# EasyEDA Pro project ProProject_PetCareSTM32_MiniSTM32_2024-08-26.epro

# Schematic Schematic1
Create Date: 2024-08-11; Page Name: P1; Project Name: PetCareSTM32_MiniSTM32; Schematic Name: Schematic1; Update Date: 2024-08-25; Company: 嘉立创EDA; Page Size: A4; Version: V1.0
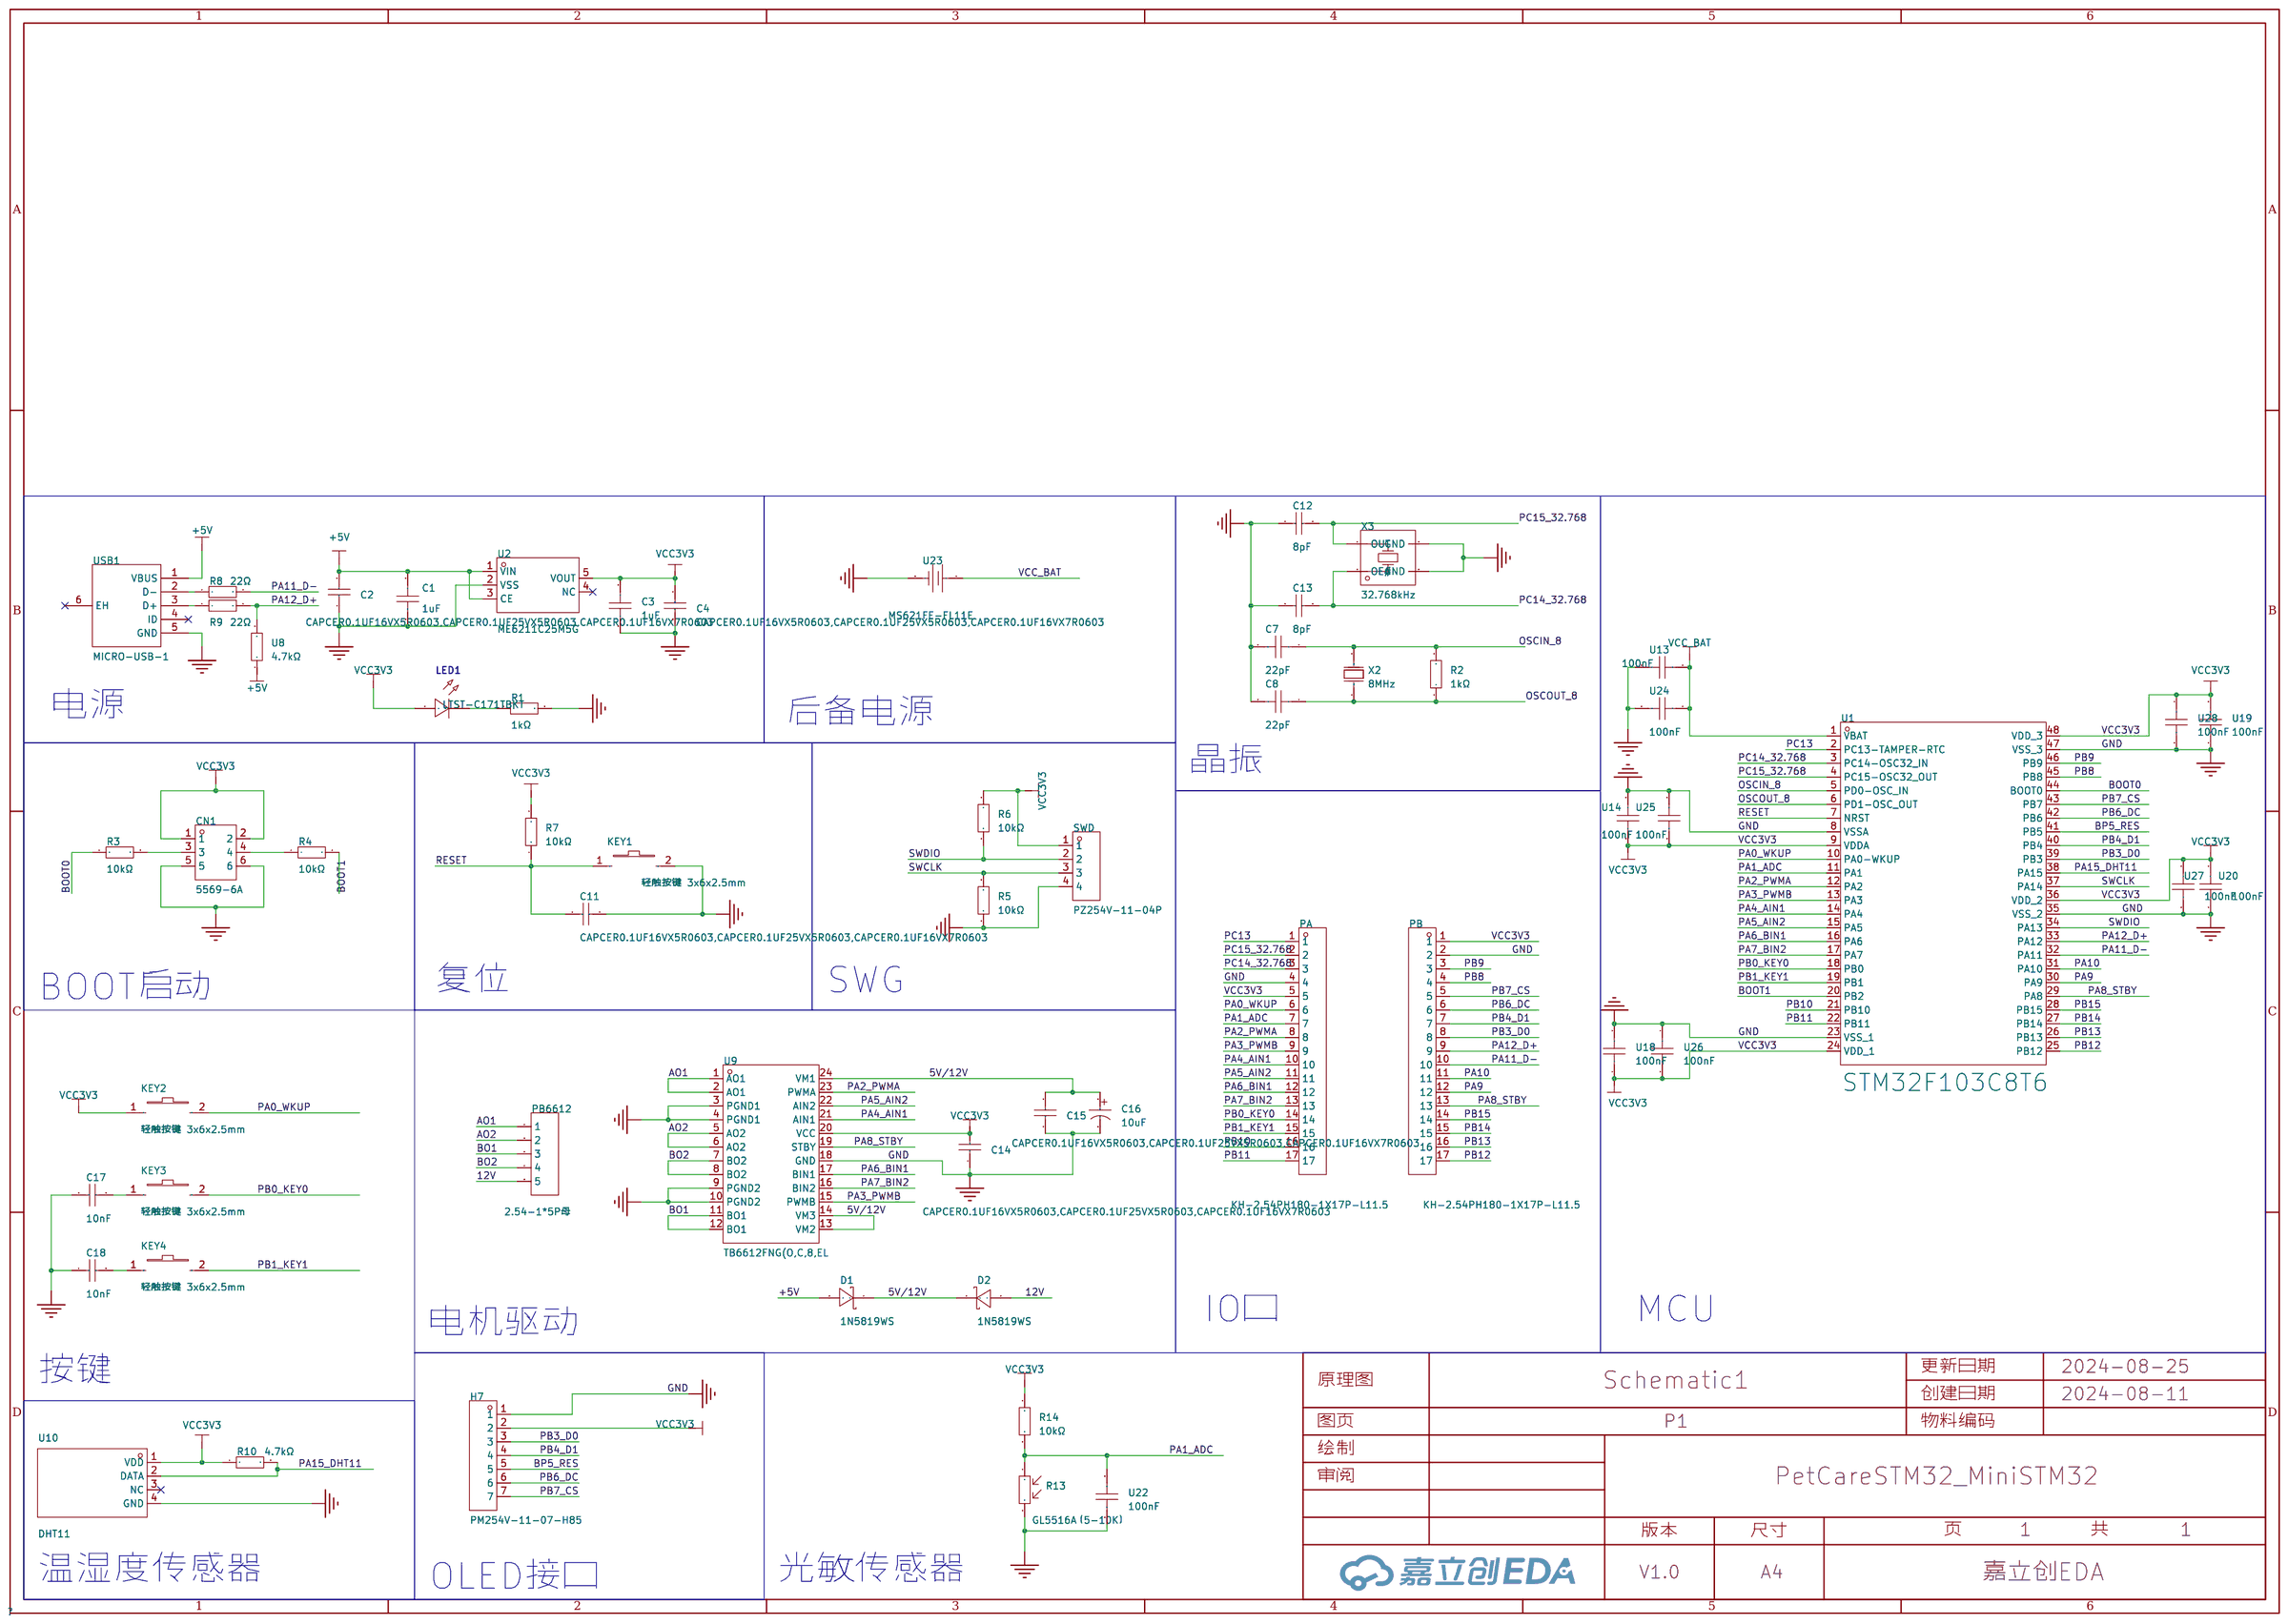
[diagram p0: schematic sheet]

## Parts
C1  1uF  [C0603]
C2  CAPCER0.1UF16VX5R0603,CAPCER0.1UF25VX5R0603,CAPCER0.1UF16VX7R0603  [C0603]
C3  1uF  [C0603]
C4  CAPCER0.1UF16VX5R0603,CAPCER0.1UF25VX5R0603,CAPCER0.1UF16VX7R0603  [C0603]
C7  22pF  [C0603]
C8  22pF  [C0603]
C11  CAPCER0.1UF16VX5R0603,CAPCER0.1UF25VX5R0603,CAPCER0.1UF16VX7R0603  [C0603]
C12  8pF  [C0603]
C13  8pF  [C0603]
C14  CAPCER0.1UF16VX5R0603,CAPCER0.1UF25VX5R0603,CAPCER0.1UF16VX7R0603  [C0603]
C15  CAPCER0.1UF16VX5R0603,CAPCER0.1UF25VX5R0603,CAPCER0.1UF16VX7R0603  [C0603]
C16  10uF  [CAP-TH_BD5.0-P2.00-D0.8-FD]
C17  10nF  [C0603]
C18  10nF  [C0603]
CN1  5569-6A  [CONN-TH_6P-P4.20_5569-6A-1]
D1  1N5819WS  [SOD-323_L1.8-W1.3-LS2.5-RD]
D2  1N5819WS  [SOD-323_L1.8-W1.3-LS2.5-RD]
H7  PM254V-11-07-H85  [HDR-TH_7P-P2.54-V-F]
KEY1  轻触按键 3x6x2.5mm  [SW-SMD_L6.0-W3.6-LS8.0]
KEY2  轻触按键 3x6x2.5mm  [SW-SMD_L6.0-W3.6-LS8.0]
KEY3  轻触按键 3x6x2.5mm  [SW-SMD_L6.0-W3.6-LS8.0]
KEY4  轻触按键 3x6x2.5mm  [SW-SMD_L6.0-W3.6-LS8.0]
LED1  LTST-C171TBKT  [LED0805-RD_BLUE]
PA  KH-2.54PH180-1X17P-L11.5  [HDR-TH_17P-P2.54-V-M]
PB  KH-2.54PH180-1X17P-L11.5  [HDR-TH_17P-P2.54-V-M]
PB6612  2.54-1*5P母  [HDR-TH_5P-P2.54-V-F]
R1  1kΩ  [R0603]
R2  1kΩ  [R0603]
R3  10kΩ  [R0603]
R4  10kΩ  [R0603]
R5  10kΩ  [R0603]
R6  10kΩ  [R0603]
R7  10kΩ  [R0603]
R8  22Ω  [R0805]
R9  22Ω  [R0805]
R10  4.7kΩ  [R1206]
R13  GL5516A（5-10K）  [RES-TH_L5.1-W4.3-P3.40_GL55]
R14  10kΩ  [R0603]
SWD  PZ254V-11-04P  [HDR-TH_4P-P2.54-V-M]
U1  STM32F103C8T6  [LQFP-48_L7.0-W7.0-P0.50-LS9.0-BL]
U2  ME6211C25M5G  [SOT-23-5_L2.9-W1.7-P0.95-LS2.8-BL]
U8  4.7kΩ  [R0603]
U9  TB6612FNG(O,C,8,EL  [SSOP-24_L8.4-W5.8-P0.65-LS7.8-BL]
U10  DHT11  [SENSOR-TH_DHT11]
U13  100nF  [C0603]
U14  100nF  [C0603]
U18  100nF  [C0603]
U19  100nF  [C0603]
U20  100nF  [C0603]
U22  100nF  [C0603]
U23  MS621FE-FL11E  [BAT-SMD_FL11E]
U24  100nF  [C0603]
U25  100nF  [C0603]
U26  100nF  [C0603]
U27  100nF  [C0603]
U28  100nF  [C0603]
USB1  MICRO-USB-1  [MICRO-USB-SMD_C9900008946]
X2  8MHz  [OSC-SMD_L5.0-W3.2]
X3  32.768kHz  [CRYSTAL-SMD_4P-L8.0-W3.8-BL]

## Library data of the parts
C1 C3 = CL10A105KB8NNNC: 容值:1uF;精度:±10%;额定电压:50V;材质(温度系数):X5R;; LCSC Part Name: 1uF ±10% 50V; Supplier Part: C15849; Manufacturer: SAMSUNG(三星); Supplier Footprint: 0603; JLCPCB Part Class: Basic Part; Datasheet: https://atta.szlcsc.com/upload/public/pdf/source/20160218/1457707763339.pdf; Supplier: LCSC; Tolerance: ±10%; Voltage Rated: 50V; Temperature Coefficient: X5R
C2 C4 C11 C14 C15 = CAPCER0.1UF16VX5R0603,CAPCER0.1UF25VX5R0603,CAPCER0.1UF16VX7R0603: Supplier Part: C9900012833; JLCPCB Part Class: Extended Part; Supplier: LCSC
C7 C8 = CL10C220JB81PNC: 容值:22pF;精度:±5%;额定电压:50V;材质(温度系数):C0G;; LCSC Part Name: 22pF ±5% 50V; Supplier Part: C170132; Manufacturer: SAMSUNG(三星); Supplier Footprint: 0603; JLCPCB Part Class: Extended Part; Datasheet: https://atta.szlcsc.com/upload/public/pdf/source/20180126/C170132_15169630833661310807.pdf; Supplier: LCSC; Tolerance: ±5%; Voltage Rated: 50V; Temperature Coefficient: C0G
C12 C13 = 0603CG8R0C500NT: 容值:8pF;额定电压:50V;材质(温度系数):C0G;; LCSC Part Name: 8pF 50V; Supplier Part: C36508; Manufacturer: FH(风华); Supplier Footprint: 0603; JLCPCB Part Class: Extended Part; Datasheet: https://atta.szlcsc.com/upload/public/pdf/source/20200305/C486355_26A10D38EF8C2A5C37091D0039909270.pdf; Supplier: LCSC; Voltage Rated: 50V; Temperature Coefficient: C0G
C16 = KF100M025C110A: 容值:10uF;精度:±20%;额定电压:25V;; LCSC Part Name: 10uF ±20% 25V; Supplier Part: C62930; Manufacturer: CapXon(丰宾); Supplier Footprint: 插件,D5xL11mm; JLCPCB Part Class: Extended Part; Datasheet: https://atta.szlcsc.com/upload/public/pdf/source/20160702/1467448308274.pdf; Supplier: LCSC; Tolerance: ±20%; Rated Voltage: 25V; Lead Spacing: 2mm; φD: 5mm; L: 11mm; Lifetime @ Temp: 2000hrs@105℃
C17 C18 = CC0603KRX7R9BB103: 容值:10nF;精度:±10%;额定电压:50V;材质(温度系数):X7R;; LCSC Part Name: 10nF ±10% 50V; Supplier Part: C100042; Manufacturer: YAGEO(国巨); Supplier Footprint: 0603; JLCPCB Part Class: Extended Part; Datasheet: https://atta.szlcsc.com/upload/public/pdf/source/20181008/C309510_22F155564471FAF6A489F7D68F34234E.pdf; Supplier: LCSC; Tolerance: ±10%; Voltage Rated: 50V; Temperature Coefficient: X7R
CN1 = 5569-6A: Supplier Part: C9900070523; Supplier Footprint: 2*3p; JLCPCB Part Class: Extended Part; Supplier: LCSC
D1 D2 = 1N5819WS_C191023: 正向压降(Vf):600mV@1A;直流反向耐压(Vr):40V;平均整流电流(Io):1A;; LCSC Part Name: 电压:40V 电流:1A; Supplier Part: C191023; Manufacturer: Hottech(合科泰); Supplier Footprint: SOD-323; JLCPCB Part Class: Basic Part; Datasheet: https://atta.szlcsc.com/upload/public/pdf/source/20220428/3CB86FD8D28D653594B4E35F9D5AEFD9.pdf; Supplier: LCSC; Forward Voltage (Vf@If): 600mV@1A; Reverse Voltage (Vr): 40V; Average Rectified Current (Io): 1A
H7 = PM254V-11-07-H85: 插孔结构:1x7P;间距:2.54mm;行距:-;圆孔/方孔:方孔;安装类型:直插;排数:单排;总孔位数:7P;额定电流:3A;额定电压:250V;插孔方向:顶部;塑高:-;工作温度范围:-40℃~+105℃;; LCSC Part Name: 间距:2.54mm 1x7P 直插; Supplier Part: C2832270; Manufacturer: XFCN(兴飞); Supplier Footprint: 插件,P=2.54mm; JLCPCB Part Class: Extended Part; Datasheet: https://atta.szlcsc.com/upload/public/pdf/source/20210514/C2832270_F424CC0071A81298BFB56B53406F9842.pdf; Supplier: LCSC; Holes Structure: 1x7P; Pitch: 2.54mm; Circular Hole / Square Hole: 方孔; Mounting Type: 直插; Number of Rows: 单排; Number of Holes: 7P; Current Rating (Max): 3A; Voltage Rating (Max): 250V; Holes Direction: 顶部; Operating Temperature Range: -40℃~+105℃
KEY1-KEY4 = 轻触按键 3x6x2.5mm: LCSC Part Name: 3x6x2.5 红头 耐高温; Supplier Part: C5382; Supplier Footprint: SMD; JLCPCB Part Class: Extended Part; Supplier: LCSC
LED1 = LTST-C171TBKT: 发光颜色:蓝色;正向电压(VF):3.3V;功率:76mW;正向电流:20mA;主波长:465nm~475nm;二极管配置:-;透镜颜色:无色透明透镜;色温:-;发光强度:104mcd;发光角度:130°;载带方式:-;工作温度:-20℃~+80℃;; LCSC Part Name: 蓝灯; Supplier Part: C98225; Manufacturer: LITEON(光宝); Supplier Footprint: 0805; JLCPCB Part Class: Extended Part; Datasheet: https://atta.szlcsc.com/upload/public/pdf/source/20170818/C98225_1503051350955895434.pdf; Supplier: LCSC; Emitted Color: 蓝色; Forward Voltage (VF): 3.3V; Power Dissipation: 76mW; Forward Current: 20mA; Dominant Wavelength: 465nm~475nm; Peak Wavelength: 468nm; Lens Color: 无色透明透镜; Luminous Intensity: 104mcd; Viewing Angle: 130°; Operating Temperature: -20℃~+80℃
PA PB = KH-2.54PH180-1X17P-L11.5: 插针结构:1x17P;间距:2.54mm;行距:-;圆针/方针:方针;安装类型:直插;排数:单排;总PIN位数:17P;额定电流:3A;额定电压:-;配合针长度:6mm;塑高:2.5mm;端接针长度:3mm;工作温度范围:-40℃~+105℃;颜色:黑色;; LCSC Part Name: 间距:2.54mm 1x17P 直插 方针; Supplier Part: C2932705; Manufacturer: kinghelm(金航标); Supplier Footprint: 插件,P=2.54mm; JLCPCB Part Class: Extended Part; Datasheet: https://atta.szlcsc.com/upload/public/pdf/source/20211220/20932CDD9C2552710798341E35ADE8E4.pdf; Supplier: LCSC; Pin Structure: 1x17P; Pitch: 2.54mm; Circluar Pins/Square Pins: 方针; Mounting Type: 直插; Number of Rows: 单排; Number of Pins: 17P; Current Rating (Max): 3A; Length of Mating Pin: 6mm; Insulation Height: 2.5mm; Length of End Connection Pin: 3mm; Operating Temperature Range: -40℃~+105℃; Color: 黑色
PB6612 = 2.54-1*5P母: 插孔结构:1x5P;间距:2.54mm;行距:-;安装类型:直插;排数:单排;总孔位数:5P;塑高:-;触头材质:-;触头镀层:-;; LCSC Part Name: 间距:2.54mm 1x5P 直插; Supplier Part: C50950; Manufacturer: BOOMELE(博穆精密); Supplier Footprint: 插件,P=2.54mm; JLCPCB Part Class: Extended Part; Datasheet: https://atta.szlcsc.com/upload/public/pdf/source/20210301/C2718488_F4427B881E42CAA8DDB0B1C12B3A522C.pdf; Supplier: LCSC; Holes Structure: 1x5P; Pitch: 2.54mm; Mounting Type: 直插; Number of Rows: 单排; Number of Holes: 5P
R1 = RC0603FR-071KL: 电阻类型:厚膜电阻;阻值:1kΩ;精度:±1%;功率:100mW;最大工作电压:75V;温度系数:±100ppm/℃;; LCSC Part Name: 厚膜电阻 1kΩ ±1% 100mW; Supplier Part: C22548; Manufacturer: YAGEO(国巨); Supplier Footprint: 0603; JLCPCB Part Class: Extended Part; Datasheet: https://atta.szlcsc.com/upload/public/pdf/source/20180316/70C0E2BDAE7FCC62C531A5A58D202EE1.pdf; Supplier: LCSC; Type: 厚膜电阻; Tolerance: ±1%; Power(Watts): 100mW; Overload Voltage (Max): 75V; Temperature Coefficient: ±100ppm/℃; Operating Temperature Range: -55℃~+155℃
R2 = 0603WAD1001T5E: 电阻类型:厚膜电阻;阻值:1kΩ;精度:±0.5%;功率:100mW;最大工作电压:75V;温度系数:±100ppm/℃;; LCSC Part Name: 1kΩ ±0.5% 100mW 厚膜电阻; Supplier Part: C51218; Manufacturer: UNI-ROYAL(厚声); Supplier Footprint: 0603; JLCPCB Part Class: Extended Part; Datasheet: https://atta.szlcsc.com/upload/public/pdf/source/20200306/C422600_1E6D84923E4A46A82E41ADD87F860B5C.pdf; Supplier: LCSC; Type: 厚膜电阻; Tolerance: ±0.5%; Power(Watts): 100mW; Overload Voltage (Max): 75V; Temperature Coefficient: ±100ppm/℃; Operating Temperature Range: -55℃~+155℃
R3-R7 R14 = 0603WAF1002T5E: 电阻类型:厚膜电阻;阻值:10kΩ;精度:±1%;功率:100mW;最大工作电压:75V;温度系数:±100ppm/℃;; LCSC Part Name: 厚膜电阻 10kΩ ±1% 100mW; Supplier Part: C25804; Manufacturer: UNI-ROYAL(厚声); Supplier Footprint: 0603; JLCPCB Part Class: Basic Part; Datasheet: https://atta.szlcsc.com/upload/public/pdf/source/20200306/C422600_1E6D84923E4A46A82E41ADD87F860B5C.pdf; Supplier: LCSC; Type: 厚膜电阻; Tolerance: ±1%; Power(Watts): 100mW; Overload Voltage (Max): 75V; Temperature Coefficient: ±100ppm/℃; Operating Temperature Range: -55℃~+155℃
R8 R9 = TC0525F220JT5E: 电阻类型:薄膜电阻;阻值:22Ω;精度:±1%;功率:250mW;最大工作电压:150V;温度系数:±25ppm/℃;; LCSC Part Name: 22Ω ±1% 250mW 薄膜电阻; Supplier Part: C65068; Manufacturer: UNI-ROYAL(厚声); Supplier Footprint: 0805; JLCPCB Part Class: Extended Part; Datasheet: https://atta.szlcsc.com/upload/public/pdf/source/20190904/C425668_F2F639A313B6F33D501F342892FD5229.pdf; Supplier: LCSC; Type: 薄膜电阻; Tolerance: ±1%; Power(Watts): 250mW; Overload Voltage (Max): 150V; Temperature Coefficient: ±25ppm/℃; Operating Temperature Range: -55℃~+155℃
R10 = 1206W4F4701T5E: 电阻类型:厚膜电阻;阻值:4.7kΩ;精度:±1%;功率:250mW;最大工作电压:200V;温度系数:±100ppm/℃;; LCSC Part Name: 4.7kΩ ±1% 250mW 厚膜电阻; Supplier Part: C17936; Manufacturer: UNI-ROYAL(厚声); Supplier Footprint: 1206; JLCPCB Part Class: Basic Part; Datasheet: https://atta.szlcsc.com/upload/public/pdf/source/20200306/C422600_1E6D84923E4A46A82E41ADD87F860B5C.pdf; Supplier: LCSC; Type: 厚膜电阻; Tolerance: ±1%; Power(Watts): 250mW; Overload Voltage (Max): 200V; Temperature Coefficient: ±100ppm/℃; Operating Temperature Range: -55℃~+155℃
R13 = GL5516A（5-10K）: 暗电阻:200kΩ;亮电阻 @ 10Lux:5kΩ~10kΩ;光谱峰值(波长):540nm;; LCSC Part Name: 亮电阻:5kΩ~10kΩ 暗电阻:200kΩ; Supplier Part: C11307; Manufacturer: JCHL(晶创和立); Supplier Footprint: 插件,P=3.4mm; JLCPCB Part Class: Extended Part; Datasheet: https://atta.szlcsc.com/upload/public/pdf/source/20200417/C515010_C10502EF7F431E893A7F20DB83F527F0.pdf; Supplier: LCSC; Dark Resistance: 200kΩ; Illuminated Resistance @ 10Lux: 5kΩ~10kΩ; Applied Voltage: 150V; Spectral Peak: 540nm
SWD = PZ254V-11-04P: 插针结构:1x4P;间距:2.54mm;行距:-;圆针/方针:方针;安装类型:直插;排数:单排;总PIN位数:4P;额定电流:3A;额定电压:250V;配合针长度:6mm;塑高:2.5mm;端接针长度:3mm;触头材质:-;工作温度范围:-40℃~+105℃;颜色:黑色;; LCSC Part Name: 间距:2.54mm 1x4P 直插 方针; Supplier Part: C2691448; Manufacturer: XFCN(兴飞); Supplier Footprint: 插件,P=2.54mm; JLCPCB Part Class: Extended Part; Datasheet: https://atta.szlcsc.com/upload/public/pdf/source/20200309/C492403_F9F19131791D08044AD4F84F8E751A34.pdf; Supplier: LCSC; Pin Structure: 1x4P; Pitch: 2.54mm; Circluar Pins/Square Pins: 方针; Mounting Type: 直插; Number of Rows: 单排; Number of Pins: 4P; Current Rating (Max): 3A; Voltage Rating (Max): 250V; Length of Mating Pin: 6mm; Insulation Height: 2.5mm; Length of End Connection Pin: 3mm; Operating Temperature Range: -40℃~+105℃; Color: 黑色
U1 = STM32F103C8T6: CPU内核:ARM-M3;程序存储容量:64KB;RAM总容量:20KB;GPIO端口数量:37;工作电压范围:2V~3.6V;CPU最大主频:72MHz;程序存储器类型:FLASH;; LCSC Part Name: 主流增强型ARM Cortex-M3 MCU，具有64 KB Flash、72 MHz CPU、电机控制、USB和CAN; Supplier Part: C8734; Manufacturer: ST(意法半导体); Supplier Footprint: LQFP-48(7x7); JLCPCB Part Class: 扩展库; Datasheet: https://atta.szlcsc.com/upload/public/pdf/source/20220812/8363ACEC51AD55ECEB84799464F7CB85.pdf; Supplier: LCSC; CPU Core: ARM-M3; Program Storage Size: 64KB; RAM Size: 20KB; GPIO Ports Number: 37; Operating Voltage Range: 2V~3.6V; CPU Maximum Speed: 72MHz; Program Memory Type: FLASH; Operating Temperature Range: -40℃~+85℃; ADC (Bit): 12bit; Universal Serial Bus: 有; Peripheral/Function: 看门狗；DMA；看门狗；温度传感器; Watchdog: 有; Infrared Data Association: 有; Low-Voltage Detect: 有; Direct Memory Access: 有; Internal Oscillator: 有
U2 = ME6211C25M5G: LCSC Part Name: ME6211C25M5G 停产; Supplier Part: C2835813; Manufacturer: MICRONE(南京微盟); Supplier Footprint: SOT-23-5; JLCPCB Part Class: Extended Part; Datasheet: https://atta.szlcsc.com/upload/public/pdf/source/20211210/ACC7C3E9BA56F250BF966425916E32B9.pdf; Supplier: LCSC
U8 = AR03FTDX4701A: 电阻类型:薄膜电阻;阻值:4.7kΩ;精度:±1%;功率:100mW;最大工作电压:75V;温度系数:±50ppm/℃;; LCSC Part Name: 薄膜电阻 4.7kΩ ±1% 100mW; Supplier Part: C2924150; Manufacturer: Viking(光颉); Supplier Footprint: 0603; JLCPCB Part Class: Extended Part; Datasheet: https://atta.szlcsc.com/upload/public/pdf/source/20211123/7AFDB03DAF68AA91648A852AAE26A3AB.pdf; Supplier: LCSC; Type: 薄膜电阻; Tolerance: ±1%; Power(Watts): 100mW; Overload Voltage (Max): 75V; Temperature Coefficient: ±50ppm/℃; Operating Temperature Range: -55℃~+155℃
U9 = TB6612FNG(O,C,8,EL: 双直流电机驱动器集成电路; Supplier Part: C88224; Manufacturer: TOSHIBA(东芝); Supplier Footprint: SSOP-24-208mil; JLCPCB Part Class: Extended Part; Datasheet: https://atta.szlcsc.com/upload/public/pdf/source/20171128/C141517_15118625624231147036.pdf; Supplier: LCSC
U10 = DHT11: 新款电容式数字温湿度传感器,老款已停产16.1x12.6x5.8mm; LCSC Part Name: DHT11  电容式传感器; Supplier Part: C117051; Manufacturer: 广州奥松; Supplier Footprint: SIP-4; JLCPCB Part Class: Extended Part; Datasheet: https://atta.szlcsc.com/upload/public/pdf/source/20170703/1499081238365.pdf; Supplier: LCSC
U13 U14 U18-U20 U22 U24-U28 = CGA0603X7R104K500JT: 容值:100nF;精度:±10%;额定电压:50V;材质(温度系数):X7R;; LCSC Part Name: 100nF ±10% 50V; Supplier Part: C6119867; Manufacturer: HRE(芯声); Supplier Footprint: 0603; JLCPCB Part Class: Extended Part; Supplier: LCSC; Tolerance: ±10%; Voltage Rated: 50V; Temperature Coefficient: X7R
U23 = MS621FE-FL11E: FL11E 3.3V可充电纽扣电池 5.5mAH; LCSC Part Name: Seiko/精工，可充电纽扣电池，3V，MS621FE-FL11E，1个; Supplier Part: C80909; Manufacturer: Seiko(精工); JLCPCB Part Class: Extended Part; Datasheet: https://atta.szlcsc.com/upload/public/pdf/source/20230719/88F2811CC6B30DD05F1C5A5953BF9E77.pdf; Supplier: LCSC; voltage: 3 V; capacity: 5.5mAh; chemical composition: 锂离子; temperature range: -20-60°C; type: 纽扣; characteristic: 可充电; Packaging quantity: 1; Battery capacity: -；-；-
USB1 = MICRO-USB-1: Supplier Part: C9900008946; Supplier Footprint: USB-micro; JLCPCB Part Class: Extended Part; Supplier: LCSC
X2 = ABM3-8.000MHZ-D2Y-T: 晶振类型:贴片晶振;频率:8MHz;常温频差:±20ppm;外接负载电容:18pF;频率稳定度(全温):±30ppm;; LCSC Part Name: 8MHz ±20ppm 18pF; Supplier Part: C144380; Manufacturer: ABRACON; Supplier Footprint: SMD5032; JLCPCB Part Class: Extended Part; Datasheet: https://atta.szlcsc.com/upload/public/pdf/source/20180613/C148313_0A3B1F233FF88ED3B220BE4C181ABF14.pdf; Supplier: LCSC; Crystal Type: 贴片晶振; Normal temperature Frequency Tolerance: ±20ppm; External load capacitor: 18pF; Frequency Stability(Full temperature range): ±30ppm; Equivalent Series Resistance (ESR): 140Ω; Operating Temperature: -40℃~+85℃
X3 = ABS25-32.768KHZ-T: 晶振类型:-;频率:32.768kHz;常温频差:±20ppm;外接负载电容:12.5pF;频率稳定度(全温):-;; LCSC Part Name: 32.768kHz ±20ppm 12.5pF; Supplier Part: C179637; Manufacturer: ABRACON; Supplier Footprint: MC-306; JLCPCB Part Class: 扩展库; Datasheet: https://atta.szlcsc.com/upload/public/pdf/source/20180207/C179637_15179896523281356363.pdf; Supplier: LCSC; Normal temperature Frequency Tolerance: ±20ppm; External load capacitor: 12.5pF; Equivalent Series Resistance (ESR): 50kΩ; Operating Temperature: -40℃~+85℃

## Nets
5V/12V: C15.2 C16.1 D1.1(K) D2.1(K) U9.13(VM2) U9.14(VM3) U9.24(VM1)
12V: D2.2(A) PB6612.5
+5V: C1.2 C2.2 D1.2(A) U2.1(VIN) U2.3(CE) U8.1 USB1.1(VBUS)
GND: C1.1 C2.1 C3.1 C4.1 C7.2 C8.2 C11.2 C12.1 C13.1 C14.1 C15.1 C16.2 C17.2 C18.1 CN1.5 CN1.6 H7.1 KEY1.2 PA.4 PB.2 R1.2 R5.1 R13.2 SWD.4 U1.8(VSSA) U1.23(VSS_1) U1.35(VSS_2) U1.47(VSS_3) U2.2(VSS) U9.3(PGND1) U9.4(PGND1) U9.9(PGND2) U9.10(PGND2) U9.18(GND) U10.4(GND) U13.2 U14.2 U18.2 U19.1 U20.1 U22.1 U23.2(-) U24.2 U25.1 U26.1 U27.2 U28.2 USB1.5(GND) X3.2(GND) X3.3(GND)
VCC3V3: C3.2 C4.2 C14.2 CN1.1 CN1.2 H7.2 KEY2.1 LED1.2(A) PA.5 PB.1 R6.2 R7.2 R10.1 R14.2 SWD.1 U1.9(VDDA) U1.24(VDD_1) U1.36(VDD_2) U1.48(VDD_3) U2.5(VOUT) U9.20(VCC) U10.1(VDD) U14.1 U18.1 U19.2 U20.2 U25.2 U26.2 U27.1 U28.1
VCC_BAT: U1.1(VBAT) U13.1 U23.1(+) U24.1
AO1: PB6612.1 U9.1(AO1) U9.2(AO1)
AO2: PB6612.2 U9.5(AO2) U9.6(AO2)
BO1: PB6612.3 U9.11(BO1) U9.12(BO1)
BO2: PB6612.4 U9.7(BO2) U9.8(BO2)
BOOT0: R3.1 U1.44(BOOT0)
BOOT1: R4.2 U1.20(PB2)
BP5_RES: H7.5 U1.41(PB5)
OSCIN_8: C7.1 R2.2 U1.5(PD0-OSC_IN) X2.2(OSC2)
OSCOUT_8: C8.1 R2.1 U1.6(PD1-OSC_OUT) X2.1(OSC1)
PA0_WKUP: KEY2.2 PA.6 U1.10(PA0-WKUP)
PA1_ADC: PA.7 R13.1 R14.1 U1.11(PA1) U22.2
PA2_PWMA: PA.8 U1.12(PA2) U9.23(PWMA)
PA3_PWMB: PA.9 U1.13(PA3) U9.15(PWMB)
PA4_AIN1: PA.10 U1.14(PA4) U9.21(AIN1)
PA5_AIN2: PA.11 U1.15(PA5) U9.22(AIN2)
PA6_BIN1: PA.12 U1.16(PA6) U9.17(BIN1)
PA7_BIN2: PA.13 U1.17(PA7) U9.16(BIN2)
PA8_STBY: PB.13 U1.29(PA8) U9.19(STBY)
PA9: PB.12 U1.30(PA9)
PA10: PB.11 U1.31(PA10)
PA11_D-: PB.10 R8.2 U1.32(PA11)
PA12_D+: PB.9 R9.2 U1.33(PA12) U8.2
PA15_DHT11: R10.2 U1.38(PA15) U10.2(DATA)
PB0_KEY0: KEY3.2 PA.14 U1.18(PB0)
PB1_KEY1: KEY4.2 PA.15 U1.19(PB1)
PB3_D0: H7.3 PB.8 U1.39(PB3)
PB4_D1: H7.4 PB.7 U1.40(PB4)
PB6_DC: H7.6 PB.6 U1.42(PB6)
PB7_CS: H7.7 PB.5 U1.43(PB7)
PB8: PB.4 U1.45(PB8)
PB9: PB.3 U1.46(PB9)
PB10: PA.16 U1.21(PB10)
PB11: PA.17 U1.22(PB11)
PB12: PB.17 U1.25(PB12)
PB13: PB.16 U1.26(PB13)
PB14: PB.15 U1.27(PB14)
PB15: PB.14 U1.28(PB15)
PC13: PA.1 U1.2(PC13-TAMPER-RTC)
PC14_32.768: C13.2 PA.3 U1.3(PC14-OSC32_IN) X3.1(OE#)
PC15_32.768: C12.2 PA.2 U1.4(PC15-OSC32_OUT) X3.4(OUT)
RESET: C11.1 KEY1.1 R7.1 U1.7(NRST)
SWCLK: R5.2 SWD.3 U1.37(PA14)
SWDIO: R6.1 SWD.2 U1.34(PA13)
$1N4524: LED1.1(C) R1.1
$1N6705: CN1.3 R3.2
$1N6712: CN1.4 R4.1
$1N8192: R8.1 USB1.2(D-)
$1N8237: R9.1 USB1.3(D+)
$1N32184: C17.1 KEY3.1
$1N32195: C18.2 KEY4.1

Not connected (* = marked no-connect by the designer): U2 4(NC)*; U10 3(NC)*; USB1 4(ID)* 6(EH)*

## Notes on the sheet
- 电源
- 后备电源
- 晶振
- BOOT启动
- 复位
- SWG
- IO口
- MCU
- 电机驱动
- 按键
- 温湿度传感器
- 光敏传感器
- OLED接口

# Board PCB1
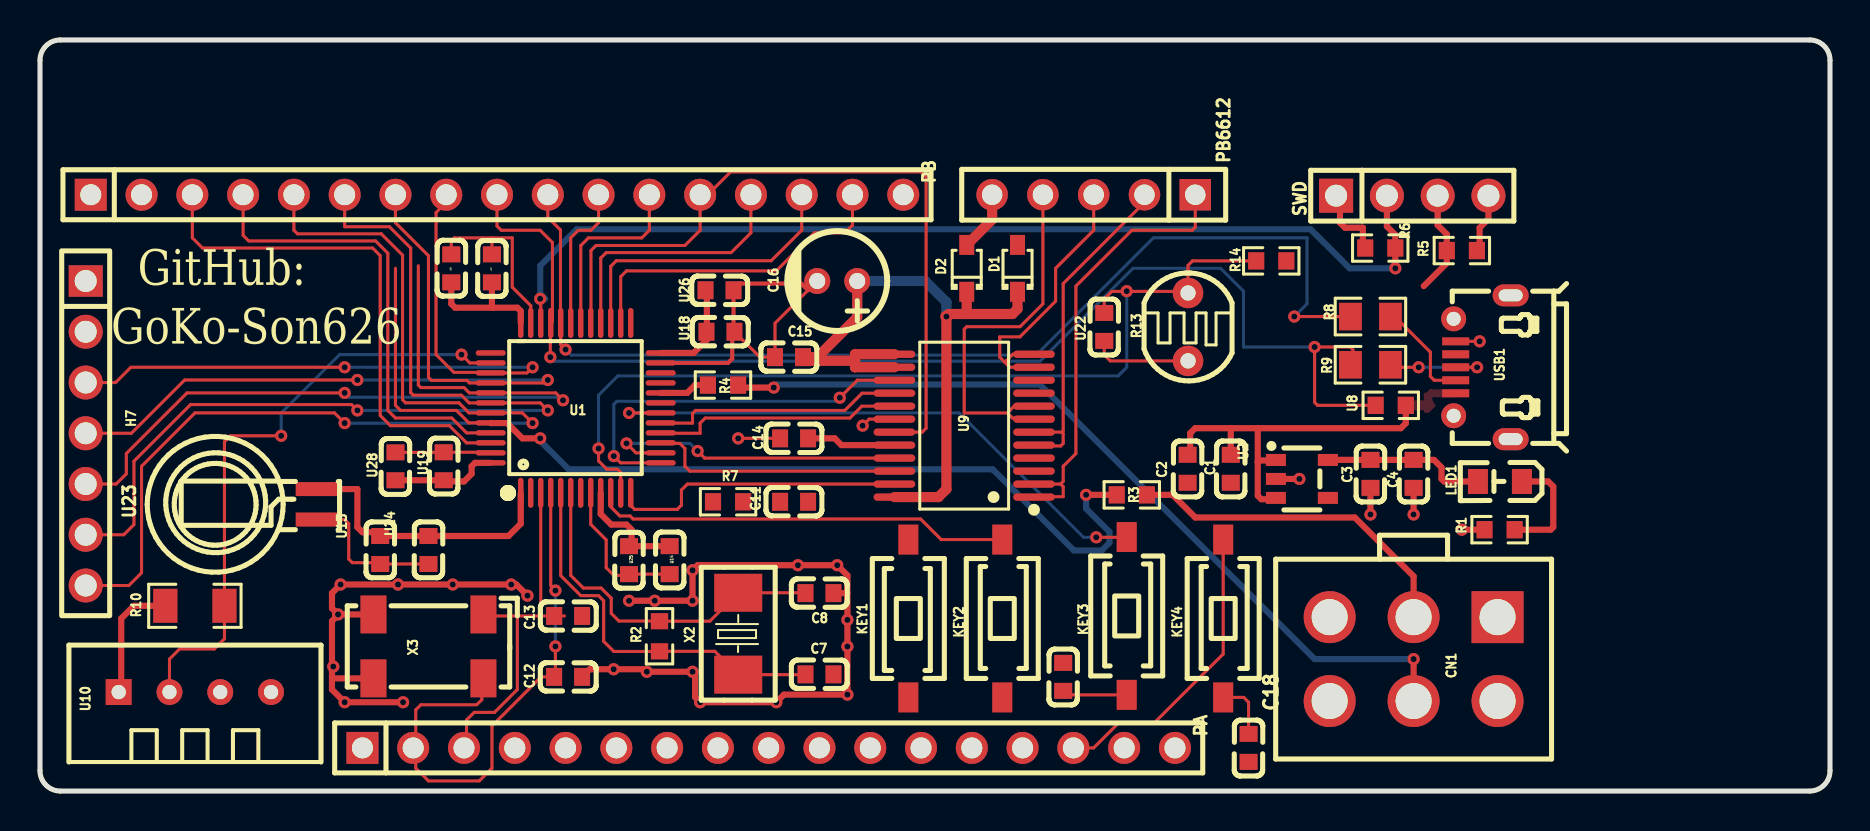
[diagram p1: board, top side]
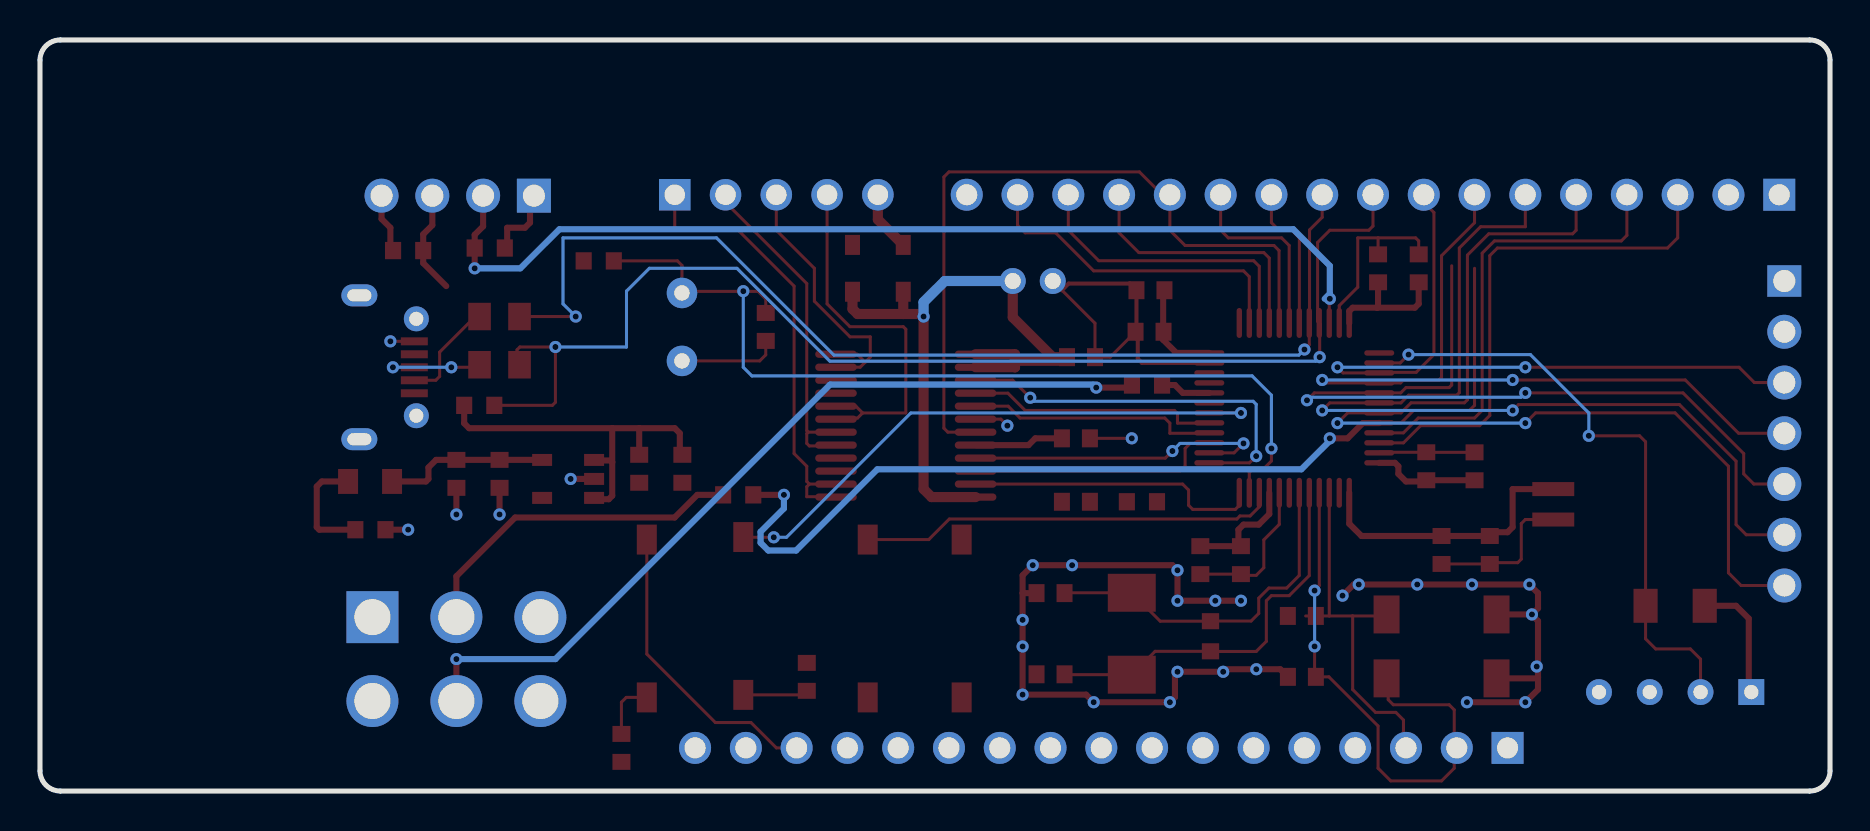
[diagram p2: board, bottom side, seen from below]

Outline 89.54 x 37.59 mm; copper layers: Top Layer, Bottom Layer. Coordinates in mm from the lower left corner of the outline.
Outline path: 0,36.58 0,1.02 arc(0.3,0.3) 1.02,0 88.52,0 arc(89.24,0.3) 89.54,1.02 89.54,36.58 arc(89.24,37.29) 88.52,37.59 1.02,37.59 arc(0.3,37.29) 0,36.58
Stack: Top Layer 0.035mm / Dielectric1 1.51mm FR4 er 4.5 / Bottom Layer 0.035mm

## Design rules (mm)
net PA11_D-: DP2
net PA12_D+: DP2
net $1N8192: DP1
net $1N8237: DP1
template: 自定义配置
spacing copperThickness1oz (default): track to track 0.203, other pairs 0.203 to 0.203
spacing copperThickness2oz: track to track 0.203, other pairs 0.152 to 0.3
track width copperThickness1oz (default): min 0.152, default 0.152, max 0.305
track width copperThickness2oz: min 0.203, default 0.254, max 2.54
track width 5V: min 0.305, default 0.305, max 0.762
track width 12V: min 0.508, default 0.508, max 0.762
differential pair differentialPair (default): width min 0.152, default 0.152, max 0.152; gap min 0.152, default 0.152
via viaSize (default): diameter min 0.61, default 0.61, max 0.61; hole min 0.305, default 0.305, max 0.305
net VCC_BAT uses 5V
net VCC3V3 uses 5V
net +5V uses 5V
net 5V/12V uses 12V
net 12V uses 12V

## Placement (name value [footprint] x y rotation side)
C1  1uF  [C0603]  59.56 16.13 90 top
C2  CAPCER0.1UF16VX5R0603,CAPCER0.1UF25VX5R0603,CAPCER0.1UF16VX7R0603  [C0603]  57.4 16.13 90 top
C3  1uF  [C0603]  66.55 15.88 90 top
C4  CAPCER0.1UF16VX5R0603,CAPCER0.1UF25VX5R0603,CAPCER0.1UF16VX7R0603  [C0603]  68.71 15.88 90 top
C7  22pF  [C0603]  38.99 5.84 0 top
C8  22pF  [C0603]  38.99 9.91 0 top
C11  CAPCER0.1UF16VX5R0603,CAPCER0.1UF25VX5R0603,CAPCER0.1UF16VX7R0603  [C0603]  37.72 14.48 0 top
C12  8pF  [C0603]  26.42 5.71 180 top
C13  8pF  [C0603]  26.42 8.76 180 top
C14  CAPCER0.1UF16VX5R0603,CAPCER0.1UF25VX5R0603,CAPCER0.1UF16VX7R0603  [C0603]  37.72 17.65 0 top
C15  CAPCER0.1UF16VX5R0603,CAPCER0.1UF25VX5R0603,CAPCER0.1UF16VX7R0603  [C0603]  37.47 21.72 0 top
C16  10uF  [CAP-TH_BD5.0-P2.00-D0.8-FD]  39.88 25.53 180 top
C17  10nF  [C0603]  51.18 5.71 90 top
C18  10nF  [C0603]  60.45 2.16 90 top
CN1  5569-6A  [CONN-TH_6P-P4.20_5569-6A-1]  68.71 6.6 180 top
D1  1N5819WS  [SOD-323_L1.8-W1.3-LS2.5-RD]  48.89 26.16 90 top
D2  1N5819WS  [SOD-323_L1.8-W1.3-LS2.5-RD]  46.36 26.16 90 top
H7  PM254V-11-07-H85  [HDR-TH_7P-P2.54-V-F]  2.29 17.91 270 top
KEY1  轻触按键 3x6x2.5mm  [SW-SMD_L6.0-W3.6-LS8.0]  43.43 8.64 270 top
KEY2  轻触按键 3x6x2.5mm  [SW-SMD_L6.0-W3.6-LS8.0]  48.13 8.64 90 top
KEY3  轻触按键 3x6x2.5mm  [SW-SMD_L6.0-W3.6-LS8.0]  54.36 8.76 90 top
KEY4  轻触按键 3x6x2.5mm  [SW-SMD_L6.0-W3.6-LS8.0]  59.18 8.64 90 top
LED1  LTST-C171TBKT  [LED0805-RD_BLUE]  73.02 15.49 180 top
PA  KH-2.54PH180-1X17P-L11.5  [HDR-TH_17P-P2.54-V-M]  36.45 2.16 0 top
PB  KH-2.54PH180-1X17P-L11.5  [HDR-TH_17P-P2.54-V-M]  22.86 29.84 0 top
PB6612  2.54-1*5P母  [HDR-TH_5P-P2.54-V-F]  52.7 29.84 180 top
R1  1kΩ  [R0603]  73.01 13.08 180 top
R2  1kΩ  [R0603]  30.99 7.75 270 top
R3  10kΩ  [R0603]  54.61 14.82 0 top
R4  10kΩ  [R0603]  34.16 20.32 180 top
R5  10kΩ  [R0603]  71.12 27.05 180 top
R6  10kΩ  [R0603]  67.04 27.18 180 top
R7  10kΩ  [R0603]  34.42 14.48 180 top
R8  22Ω  [R0805]  66.55 23.75 180 top
R9  22Ω  [R0805]  66.55 21.34 180 top
R10  4.7kΩ  [R1206]  7.75 9.27 0 top
R13  GL5516A（5-10K）  [RES-TH_L5.1-W4.3-P3.40_GL55]  57.42 23.23 0 top
R14  10kΩ  [R0603]  61.59 26.53 0 top
SWD  PZ254V-11-04P  [HDR-TH_4P-P2.54-V-M]  68.64 29.8 0 top
U1  STM32F103C8T6  [LQFP-48_L7.0-W7.0-P0.50-LS9.0-BL]  26.8 19.18 0 top
U2  ME6211C25M5G  [SOT-23-5_L2.9-W1.7-P0.95-LS2.8-BL]  63.12 15.62 270 top
U8  4.7kΩ  [R0603]  67.56 19.3 180 top
U9  TB6612FNG(O,C,8,EL  [SSOP-24_L8.4-W5.8-P0.65-LS7.8-BL]  46.23 18.29 90 top
U10  DHT11  [SENSOR-TH_DHT11]  7.75 4.95 0 top
U13  100nF  [C0603]  17.02 12.06 270 top
U14  100nF  [C0603]  31.5 11.56 270 top
U18  100nF  [C0603]  34.04 22.99 0 top
U19  100nF  [C0603]  20.19 16.26 270 top
U20  100nF  [C0603]  20.57 26.16 270 top
U22  100nF  [C0603]  53.23 23.23 90 top
U23  MS621FE-FL11E  [BAT-SMD_FL11E]  13.84 14.35 0 top
U24  100nF  [C0603]  19.43 12.06 270 top
U25  100nF  [C0603]  29.46 11.56 90 top
U26  100nF  [C0603]  33.99 25.07 180 top
U27  100nF  [C0603]  22.61 26.16 90 top
U28  100nF  [C0603]  17.78 16.25 90 top
USB1  MICRO-USB-1  [MICRO-USB-SMD_C9900008946]  72.14 21.21 90 top
X2  8MHz  [OSC-SMD_L5.0-W3.2]  34.92 7.87 270 top
X3  32.768kHz  [CRYSTAL-SMD_4P-L8.0-W3.8-BL]  19.43 7.24 180 top

## Footprints (pads in the part's own frame, mm; a bottom-side part is the same pattern mirrored in y, then rotated)
BAT-SMD_FL11E
  rect 2.1x0.7 smd: 1(0,0.762) 2(0,-0.762)
C0603
  rect 0.8x0.9 smd: 1(-0.7,0) 2(0.7,0)
CAP-TH_BD5.0-P2.00-D0.8-FD
  round 1.3 hole 0.8: 1(-1,0) 2(1,0)
CONN-TH_6P-P4.20_5569-6A-1
  rect 2.6x2.6 hole 1.8: 1(-4.2,-2.1)
  round 2.6 hole 1.8: 2(-4.2,2.1) 3(0,-2.1) 4(0,2.1) 5(4.2,-2.1) 6(4.2,2.1)
CRYSTAL-SMD_4P-L8.0-W3.8-BL
  rect 1.3x1.9 smd: 1(-2.75,-1.6) 2(2.75,-1.6) 3(2.75,1.6) 4(-2.75,1.6)
HDR-TH_4P-P2.54-V-M
  rect 1.7x1.7 hole 1.1: 1(-3.81,0)
  round 1.7 hole 1.1: 2(-1.27,0) 3(1.27,0) 4(3.81,0)
HDR-TH_5P-P2.54-V-F
  rect 1.575x1.575 hole 1.02: 1(-5.08,0)
  round 1.575 hole 1.02: 2(-2.54,0) 3(0,0) 4(2.54,0) 5(5.08,0)
HDR-TH_7P-P2.54-V-F
  rect 1.575x1.7 hole 1.1: 1(-7.62,0)
  round 1.7 hole 1.1: 2(-5.08,0) 3(-2.54,0) 4(0,0) 5(2.54,0) 6(5.08,0) 7(7.62,0)
HDR-TH_17P-P2.54-V-M
  rect 1.6x1.6 hole 1.05: 1(-20.32,0)
  round 1.6 hole 1.05: 2(-17.78,0) 3(-15.24,0) 4(-12.7,0) 5(-10.16,0) 6(-7.62,0) 7(-5.08,0) 8(-2.54,0) 9(0,0) 10(2.54,0) 11(5.08,0) 12(7.62,0) 13(10.16,0) 14(12.7,0) 15(15.24,0) 16(17.78,0) 17(20.32,0)
LED0805-RD_BLUE
  rect 1x1.25 smd: 1(-1.1,0) 2(1.1,0)
LQFP-48_L7.0-W7.0-P0.50-LS9.0-BL
  oval 0.27x1.5 smd: 1(-2.75,-4.25) 2(-2.25,-4.25) 3(-1.75,-4.25) 4(-1.25,-4.25) 5(-0.75,-4.25) 6(-0.25,-4.25) 7(0.25,-4.25) 8(0.75,-4.25) 9(1.25,-4.25) 10(1.75,-4.25) 11(2.25,-4.25) 12(2.75,-4.25) 25(2.75,4.25) 26(2.25,4.25) 27(1.75,4.25) 28(1.25,4.25) 29(0.75,4.25) 30(0.25,4.25) 31(-0.25,4.25) 32(-0.75,4.25) 33(-1.25,4.25) 34(-1.75,4.25) 35(-2.25,4.25) 36(-2.75,4.25)
  oval 1.5x0.27 smd: 13(4.25,-2.75) 14(4.25,-2.25) 15(4.25,-1.75) 16(4.25,-1.25) 17(4.25,-0.75) 18(4.25,-0.25) 19(4.25,0.25) 20(4.25,0.75) 21(4.25,1.25) 22(4.25,1.75) 23(4.25,2.25) 24(4.25,2.75) 37(-4.25,2.75) 38(-4.25,2.25) 39(-4.25,1.75) 40(-4.25,1.25) 41(-4.25,0.75) 42(-4.25,0.25) 43(-4.25,-0.25) 44(-4.25,-0.75) 45(-4.25,-1.25) 46(-4.25,-1.75) 47(-4.25,-2.25) 48(-4.25,-2.75)
MICRO-USB-SMD_C9900008946
  rect 0.4x1.35 smd: 1(-1.3,1.325) 2(-0.65,1.325) 3(0,1.325) 4(0.65,1.325) 5(1.3,1.325)
  oval 1.1x1.8 hole 0.6x1.2: 6(-3.6,-1.425) 6(3.6,-1.425)
  round 1.25 hole 0.7: 6(-2.425,1.425) 6(2.425,1.425)
OSC-SMD_L5.0-W3.2
  rect 1.9x2.4 smd: 1(-2.05,0) 2(2.05,0)
R0603
  rect 0.806x0.864 smd: 1(-0.753,0) 2(0.753,0)
R0805
  rect 1.133x1.377 smd: 1(-1,0) 2(1,0)
R1206
  rect 1.208x1.701 smd: 1(-1.479,0) 2(1.479,0)
RES-TH_L5.1-W4.3-P3.40_GL55
  round 1.524 hole 0.762: 1(0,1.7) 2(0,-1.7)
SENSOR-TH_DHT11
  rect 1.296x1.296 hole 0.711: 1(-3.81,0)
  round 1.296 hole 0.711: 2(-1.27,0) 3(1.27,0) 4(3.81,0)
SOD-323_L1.8-W1.3-LS2.5-RD
  rect 1x0.75 smd: 1(-1.173,0) 2(1.173,0)
SOT-23-5_L2.9-W1.7-P0.95-LS2.8-BL
  rect 0.6x1 smd: 1(-0.95,-1.3) 2(0,-1.3) 3(0.95,-1.3) 4(0.95,1.3) 5(-0.95,1.3)
SSOP-24_L8.4-W5.8-P0.65-LS7.8-BL
  oval 0.364x2.082 smd: 1(-3.575,-3.491) 2(-2.925,-3.491) 3(-2.275,-3.491) 4(-1.625,-3.491) 5(-0.975,-3.491) 6(-0.325,-3.491) 7(0.325,-3.491) 8(0.975,-3.491) 9(1.625,-3.491) 10(2.275,-3.491) 11(2.925,-3.491) 12(3.575,-3.491) 13(3.575,3.491) 14(2.925,3.491) 15(2.275,3.491) 16(1.625,3.491) 17(0.975,3.491) 18(0.325,3.491) 19(-0.325,3.491) 20(-0.975,3.491) 21(-1.625,3.491) 22(-2.275,3.491) 23(-2.925,3.491) 24(-3.575,3.491)
SW-SMD_L6.0-W3.6-LS8.0
  rect 1.5x1 smd: 1(-3.95,0) 2(3.95,0)

## Nets
As in the schematic.

Pads without a net: U2 4; U10 3; USB1 4 6

## Via types
v1: diameter 0.61, hole 0.305, Top Layer to Bottom Layer, 65 vias

## Routing (per net, layer and track width the routed paths; a pad name or vN(x,y) marks a point on that pad's centre or on a via; arc(x,y) is an arc through that point)
5V/12V: length 35.3
  Top Layer w0.508: 46.36,23.88 48.64,23.88 48.89,24.13 D1.1 ; 46.36,23.88 45.47,23.88 v1(45.34,23.75) 45.34,15.11 44.94,14.71 U9.24 ; 46.36,23.88 D2.1 ; 40.77,21.53 40.77,21.21 40.77,21.21 U9.14 ; 40.77,21.53 40.77,21.86 U9.13 ; 40.77,21.53 38.35,21.53 C15.2 38.88,21.72 40.88,23.71 C16.1
  Bottom Layer w0.508: v1(45.34,23.75) 45.34,24.47 44.28,25.53 C16.1
12V: length 2.7
  Top Layer w0.508: D2.2 47.63,28.6 47.63,29.46
+5V: length 19.5
  Top Layer w0.305: 60.91,18.16 68.07,18.16 68.32,18.41 U8.1 ; 60.91,18.16 60.91,16.46 ; 60.91,18.16 59.56,18.16 ; 60.91,16.46 61,16.55 61.79,16.55 U2.1 ; 60.91,16.46 60.91,14.78 61.09,14.6 61.65,14.6 ; 59.56,18.16 59.56,18.16 C1.2 ; 59.56,18.16 57.79,18.16 57.53,17.91 57.53,16.96 C2.2
GND: length 122.9
  Top Layer w0.152: 38.42,25.07 36.77,23.41 C15.1 36.01,21.72 U18.2 ; U1.8 27.55,13.35 28.32,12.57 28.32,11.18 28.7,10.8 29.53,10.8 29.59,10.86 31.37,10.86 31.43,10.79 ; U20.1 20.57,27.53 20.73,27.69 22.61,27.69 ; U9.18 41.47,18.61 v1(41.15,18.29) ; R13.2 53.54,21.53 53.23,21.83 U22.1 ; U1.35 24.55,24.29 23.62,25.22 23.62,27.69 22.61,27.69 ; 22.61,27.69 U27.2 ; U28.2 20.19,16.95 20.19,16.96 22.52,16.96 U1.47 ; U24.2 U13.2 16.95,11.43 15.62,11.43 15.44,11.61 15.44,13.39 15.24,13.59 U23.2 ; C14.1 v1(34.92,17.65) ; USB1.5 v1(72.01,22.51)
  Top Layer w0.203: U1.23 34.42,21.43 34.63,21.64 34.63,22.59 34.69,22.65 U26.1 35.02,25.4 38.08,25.4 38.42,25.07 C16.2
  Top Layer w0.305: 40.39,9.91 40.39,10.8 v1(39.88,11.3) v1(37.91,11.3) 32.89,11.3 v1(32.64,11.05) v1(32.64,9.52) v1(30.75,9.52) v1(29.46,9.52) ; 40.39,9.91 C8.2 ; 40.39,9.91 v1(40.39,8.57) v1(40.39,7.23) v1(40.39,4.83) 37.21,4.83 v1(36.83,4.44) v1(33.02,4.44) 32.77,4.7 32.77,5.84 v1(32.64,5.97) v1(30.35,5.97) 30.23,6.1 v1(28.7,6.1) 27.5,6.1 C12.1 ; X3.2 14.94,8.84 ; 14.94,8.84 v1(14.91,8.84) 14.61,9.14 14.61,9.91 v1(15.04,10.34) v1(17.91,10.34) v1(20.65,10.34) v1(23.57,10.34) 23.83,10.34 v1(24.38,9.78) ; 14.94,8.84 14.61,8.51 14.61,5.7 ; 18.29,4.44 v1(15.24,4.44) 14.61,5.08 14.61,5.7 ; C4.1 v1(68.71,13.84) ; SWD.4 72.45,28.64 72.01,28.19 72.01,27.19 R5.1 ; X3.3 14.67,5.64 14.61,5.7 ; U2.2 v1(62.99,15.62) ; C3.1 v1(66.55,13.84) ; 72.25,13.08 v1(71.12,13.08)
  Bottom Layer w0.305: v1(66.55,13.84) 66.55,13.72
  vias: v1(14.67,6.23) v1(18.16,4.44)
VCC3V3: length 45.4
  Top Layer w0.305: R6.2 66.17,27.3 66.17,28.19 65.28,28.19 65.02,28.45 65.02,29.6 SWD.1 ; U28.1 17.78,15.56 U19.2 20.26,15.49 21.21,15.49 21.59,15.88 21.59,16.26 21.76,16.43 U1.48 ; 33.36,22.59 32.69,21.93 U1.24 ; 33.36,22.59 33.36,25 U26.2 ; 33.36,22.59 33.29,22.65 ; 31.49,12.19 31.43,12.26 29.59,12.26 29.59,13.08 29.34,13.33 28.58,13.33 28.05,13.86 U1.9 ; 22.66,24.19 20.77,24.19 20.57,24.38 U20.2 ; 22.66,24.19 23.88,24.19 24.05,24.02 U1.36 ; 22.66,24.19 22.61,24.24 U27.1 ; 64.54,16.57 C3.2 C4.2 69.72,16.57 70.1,16.19 70.1,15.62 70.23,15.49 LED1.2 ; C14.2 39.75,17.65 40.09,17.31 U9.20 ; U10.1 4.06,5.08 4.06,8.64 4.7,9.27 R10.1
VCC_BAT: length 14.1
  Top Layer w0.305: U1.1 24.05,13.38 23.43,12.77 U24.1 U13.1 16.83,12.95 16.13,12.95 15.88,13.21 15.88,15.11 U23.1
AO1: length 22.1
  Top Layer w0.152: U9.1 49.74,14.73 51.18,14.73 51.18,15.23 51.05,15.36 ; 57.79,29.46 57.79,28.22 57.63,28.07 54.61,28.07 51.82,25.27 51.82,16.89 51.18,16.26 51.18,15.49 51.05,15.36 ; 51.05,15.36 U9.2
AO2: length 16.7
  Top Layer w0.152: 51.11,17.96 U9.6 ; 51.11,17.96 51.18,18.03 51.18,25.4 55.25,29.46 ; 51.11,17.96 51.18,17.89 51.18,17.4 51.05,17.27 49.76,17.27 U9.5
BO1: length 13.8
  Top Layer w0.152: 48.26,21.46 48.66,21.86 U9.12 ; 48.26,21.46 48.51,21.21 U9.11 ; 48.26,21.46 48.01,21.72 48.01,22.73 49.02,22.73 50.8,24.52 50.8,26.16 52.7,28.07 52.7,29.46
BO2: length 18.8
  Top Layer w0.152: U9.8 48.73,19.26 48.39,18.92 ; 48.39,18.92 46.23,18.92 46.23,23.11 46.36,23.24 49.02,23.24 50.17,24.38 50.17,29.46 ; 48.39,18.92 48.64,18.67 49.66,18.67 U9.7
BOOT0: length 50.4
  Top Layer w0.152: 17.78,26.16 17.78,19.3 18.03,19.05 20.83,19.05 21.45,18.43 U1.44
  Top Layer w0.305: U1.44 22.56,18.42 23.37,18.42 24.13,17.65 v1(25.02,17.65) ; R3.1 v1(52.32,14.82)
  Bottom Layer w0.305: v1(25.02,17.65) 24.89,17.65 26.44,16.1 47.65,16.1 51.71,12.04 53.11,12.04 53.49,12.43 53.49,12.97 52.32,14.14 v1(52.32,14.82)
BOOT1: length 2.5
  Top Layer w0.305: R4.2 32.77,20.32 32.37,19.93 U1.20
BP5_RES: length 40
  Top Layer w0.152: H7.5 3.81,15.37 4.32,15.88 4.32,16.89 7.35,19.93 v1(15.24,19.93) ; 18.92,26.29 18.92,20.32 19.05,20.19 21.21,20.19 21.48,19.93 U1.41 25.79,19.93 v1(26.16,19.56)
  Bottom Layer w0.152: v1(26.16,19.56) 26.01,19.71 15.46,19.71 v1(15.24,19.93)
OSCIN_8: length 19.6
  Top Layer w0.152: C7.1 38.27,5.82 X2.2 33.76,6.99 R2.2 30.98,6.98 28.7,6.98 28.19,7.49 28.19,9.52 27.94,9.78 27.05,9.78 26.05,10.78 U1.5
OSCOUT_8: length 17.9
  Top Layer w0.152: C8.1 38.27,9.92 X2.1 33.5,8.5 R2.1 30.98,8.51 28.96,8.51 28.58,8.89 28.58,9.65 28.07,10.16 27.18,10.16 26.55,10.79 U1.6
PA0_WKUP: length 21
  Top Layer w0.152: KEY2.2 45.08,12.59 44.05,13.62 29.67,13.62 29.52,13.77 29.01,13.77 28.55,14.23 U1.10
PA1_ADC: length 46.5
  Top Layer w0.152: U1.11 29.05,15.95 28.89,16.1 28.36,16.1 27.94,16.52 v1(27.94,17.14) ; R14.1 57.65,26.53 57.42,26.31 R13.1 57.35,25.01 54.33,25.01 ; 54.33,25.01 54.34,25.02 v1(54.36,25.02) ; 54.33,25.01 53.61,25.01 53.23,24.63 U22.2
  Bottom Layer w0.152: v1(54.36,25.02) 54.36,21.21 53.92,20.78 28.91,20.78 27.94,19.81 v1(27.94,17.14)
PA2_PWMA: length 14.6
  Top Layer w0.152: U1.12 29.59,14.88 29.59,14.25 29.74,14.1 31.88,14.1 32.08,14.3 32.08,15.07 32.38,15.36 42.48,15.36
PA3_PWMB: length 19.4
  Top Layer w0.152: v1(40.01,19.69) 40.88,20.56 42.48,20.56 ; U1.13 29.04,16.43 v1(28.7,16.76)
  Bottom Layer w0.152: v1(28.7,16.76) 28.7,19.35 28.85,19.51 39.83,19.51 v1(40.01,19.69)
PA4_AIN1: length 15.4
  Top Layer w0.152: v1(29.34,17.4) 29.81,16.93 U1.14 ; 32.92,17.04 v1(32.89,17.02) 33.25,16.66 42.48,16.66
  Bottom Layer w0.152: v1(29.34,17.4) 32.51,17.4 v1(32.89,17.02)
PA5_AIN2: length 12.5
  Top Layer w0.152: U1.15 31.08,17.4 32,17.4 32.26,17.14 32.26,16.26 32.5,16.01 42.48,16.01
PA6_BIN1: length 12.3
  Top Layer w0.152: 42.48,19.26 41.11,19.26 40.51,18.67 33.27,18.67 33.02,18.41 33.02,17.91 31.07,17.91 U1.16
PA7_BIN2: length 12.3
  Top Layer w0.152: 42.48,19.91 41.12,19.91 40.26,19.05 32.79,19.05 32.64,18.9 32.64,18.41 31.06,18.41 U1.17
PA8_STBY: length 37.4
  Top Layer w0.152: U1.29 27.56,23.44 27.56,27.05 27.81,27.3 32.26,27.3 33.02,28.07 33.02,29.46 34.54,30.99 44.07,30.99 44.32,30.73 44.32,18.16 44.13,17.96 42.48,17.96
PA9: length 9
  Top Layer w0.152: 30.48,29.46 30.48,28.07 30.1,27.69 27.43,27.69 27.05,27.3 27.05,23.43 U1.30
PA10: length 7
  Top Layer w0.152: 27.94,29.46 27.94,28.45 27.56,28.07 26.92,28.07 26.54,27.69 26.54,23.43 U1.31
PA11_D-: length 54.4
  Top Layer w0.152: v1(26.29,22.1) 26.05,22.34 U1.32 26.04,23.44 26.04,28.08 25.4,28.72 25.4,29.46 ; R8.2 v1(62.74,23.75)
  Bottom Layer w0.152: v1(62.74,23.75) 63.37,24.38 63.37,27.69 55.69,27.69 49.83,21.82 26.57,21.82 v1(26.29,22.1)
PA12_D+: length 62.3
  Top Layer w0.152: v1(25.53,21.72) 25.53,23.41 U1.33 25.63,23.51 25.63,27.45 25.02,28.07 23.07,28.07 22.86,28.28 22.86,29.46 ; U8.2 63.91,19.3 63.75,19.46 v1(63.75,22.22) 65.53,22.22 65.67,22.08 65.67,21.21
  Bottom Layer w0.152: v1(25.53,21.72) 25.73,21.51 50.02,21.51 54.67,26.16 59.05,26.16 60.2,25.02 60.2,22.22 v1(63.75,22.22)
PA15_DHT11: length 30.7
  Top Layer w0.152: v1(21.08,21.84) 21.5,21.43 U1.38 ; v1(12.06,17.78) 9.53,17.78 9.23,17.48 R10.2 9.23,7.62 8.72,7.11 6.98,7.11 6.48,6.6 U10.2
  Bottom Layer w0.152: v1(12.06,17.78) 12.06,18.92 14.99,21.84 v1(21.08,21.84)
PB0_KEY0: length 29.1
  Top Layer w0.152: KEY3.2 54.34,12.7 v1(52.83,12.7) ; v1(29.46,18.92) 31.04,18.92 U1.18
  Bottom Layer w0.152: v1(29.46,18.92) 45.97,18.92 52.2,12.7 v1(52.83,12.7)
PB1_KEY1: length 15.2
  Top Layer w0.152: KEY4.2 59.18,6.86 55.75,3.43 53.97,3.43 52.7,2.16 PA.15
PB3_D0: length 35.8
  Top Layer w0.152: v1(15.24,21.21) 4.55,21.21 3.78,20.45 H7.3 ; v1(24.64,21.21) 24.36,20.93 U1.39 22.52,20.95 20.7,20.95 19.81,21.84 19.81,28.96 20.32,29.46
  Bottom Layer w0.152: v1(24.64,21.21) v1(15.24,21.21)
PB4_D1: length 39.8
  Top Layer w0.152: 17.78,29.46 17.78,28.44 19.43,26.79 19.43,20.7 19.58,20.55 21.36,20.55 21.48,20.43 U1.40 25.25,20.43 v1(25.4,20.57) ; H7.4 4.57,17.91 7.24,20.57 v1(15.88,20.57)
  Bottom Layer w0.152: v1(25.4,20.57) v1(15.88,20.57)
PB6_DC: length 47.2
  Top Layer w0.152: v1(25.4,19.05) 25.02,19.43 U1.42 21.46,19.43 21.08,19.81 18.67,19.81 18.54,19.94 18.54,27.18 17.48,28.24 15.24,28.24 15.24,29.46 ; v1(15.88,19.05) 15.58,19.34 7.53,19.34 4.7,16.51 4.7,13.33 4.19,12.83 H7.6
  Bottom Layer w0.152: v1(15.88,19.05) v1(25.4,19.05)
PB7_CS: length 50.8
  Top Layer w0.152: H7.7 4.45,10.29 5.08,10.92 5.08,16.26 7.75,18.93 14.73,18.93 v1(15.24,18.41) ; v1(24.64,18.41) 24.13,18.93 U1.43 21.46,18.93 20.95,19.43 18.29,19.43 18.14,19.58 18.14,26.82 17.07,27.89 12.88,27.89 12.7,28.07 12.7,29.46
  Bottom Layer w0.152: v1(15.24,18.41) v1(24.64,18.41)
PB8: length 22.7
  Top Layer w0.152: 10.16,29.46 10.16,27.81 10.44,27.53 16.78,27.53 17.4,26.92 17.4,19.05 17.78,18.67 20.6,18.67 21.34,17.93 U1.45
PB9: length 25.6
  Top Layer w0.152: U1.46 21.34,17.43 20.48,18.29 17.53,18.29 17.02,18.8 17.02,26.8 16.64,27.18 8.13,27.18 7.62,27.69 7.62,29.46
PB13: length 16.1
  Top Layer w0.152: 40.64,29.46 40.64,28.32 40.26,27.94 38.73,27.94 36.83,26.03 29.34,26.03 29.05,25.74 U1.26
PB14: length 14.5
  Top Layer w0.152: U1.27 28.55,26.26 28.83,26.54 36.58,26.54 38.1,28.07 38.1,29.46
PB15: length 12.8
  Top Layer w0.152: 35.56,29.46 35.56,27.94 34.57,26.95 28.32,26.95 28.05,26.68 U1.28
PC14_32.768: length 18
  Top Layer w0.152: 23.88,8.76 22.26,8.76 X3.1 ; 23.88,8.76 25.05,8.76 ; 23.88,8.76 23.88,8.76 23.88,5.08 22.73,3.94 21.72,3.94 21.34,3.56 21.34,2.67 ; 25.05,8.76 C13.2 26.23,8.76 ; 25.05,8.76 U1.3
PC15_32.768: length 27.4
  Top Layer w0.152: v1(25.78,7.24) 25.78,5.78 C12.2 25.06,5.71 22.61,3.26 22.61,1.14 21.97,0.51 19.43,0.51 18.8,1.14 18.8,4.06 19.05,4.32 21.84,4.32 22.1,4.57 22.1,5.56 X3.4 ; U1.4 25.55,10.29 25.78,10.05 v1(25.78,10.03)
  Bottom Layer w0.152: v1(25.78,10.03) v1(25.78,7.24)
SWCLK: length 5.2
  Top Layer w0.305: 69.22,25.27 70.37,26.42 R5.2 70.37,27.86 69.91,28.32 SWD.3
SWDIO: length 51.1
  Top Layer w0.152: v1(25.02,24.64) 25.05,24.61 U1.34
  Top Layer w0.305: v1(67.79,26.16) R6.1 67.79,27.84 67.37,28.26 SWD.2
  Bottom Layer w0.305: v1(67.79,26.16) 65.51,26.16 63.55,28.12 26.85,28.12 25.02,26.29 25.02,24.89 25.27,24.64
$1N4524: length 5.7
  Top Layer w0.305: LED1.1 75.44,15.49 75.69,15.24 75.69,13.21 75.57,13.08 R1.1
$1N6705: length 17.1
  Top Layer w0.305: R3.2 56.66,14.82 57.79,13.69 65.77,13.69 68.71,10.75 CN1.3
$1N6712: length 41.8
  Top Layer w0.305: 34.92,20.45 35.17,20.19 v1(36.7,20.19) ; v1(68.71,6.6) 68.71,4.5
  Bottom Layer w0.305: v1(68.71,6.6) 63.75,6.6 50.01,20.35 36.86,20.35 v1(36.7,20.19)
$1N8192: length 5.3
  Top Layer w0.152: R8.1 67.67,23.62 67.89,23.62 69.55,21.97 69.55,20.75 69.74,20.56 USB1.2
$1N8237: length 5.5
  Top Layer w0.152: USB1.3 v1(71.88,21.21) ; v1(68.96,21.21) 67.67,21.21 R9.1
  Bottom Layer w0.152: v1(71.88,21.21) v1(68.96,21.21)
$1N32184: length 3.3
  Top Layer w0.152: C17.1 51.38,4.81 KEY3.1
$1N32195: length 3
  Top Layer w0.152: C18.2 60.45,4.44 60.21,4.69 KEY4.1

## Copper pours and planes (outline as drawn; the poured copper is in the pictures)
+5V on Top Layer: 71.63,19.94 71.25,19.56 70.33,19.56 70.08,19.3 69.85,19.3 69.47,18.92 69.09,18.92 68.96,18.8 67.89,18.8 67.89,19.89 67.95,19.94 69.34,19.94 69.6,20.19 71.5,20.19 71.63,20.07

## Text on the board
Top Silkscreen Layer: GitHub: / GoKo-Son626
